# Altium schematic sheet Sheet1.SchDoc
size A4; DocumentNumber: 1; Revision: 0.1; SheetNumber: 1; SheetTotal: 1; HTL_Gruppe: I; HTL_Klasse: 5CHEL; HTL_Zusaetzlicher_Titel: With Arduino; HTL_Schueler_Name: Lukas Krahbichler; PageSetup: Record=PageOptions|CenterHorizontal=True|CenterVertical=True|PrintScale=1.00|XCorrection=1.00|YCorrection=1.00|PrintKind=0|BorderSize=5000000|LeftOffset=0|BottomOffset=0|Orientation=2|PaperLength=1000|PaperWidth=1000|Scale=100|PaperSource=7|PrintQuality=-4|MediaType=1|DitherType=10|PaperKind=A4|PrintScaleMode=1; HTL_Projektname: Diploma PCB; HTL_Dokumentenart: Draft; HTL_Dokumentenstatus: In Progress; SPICEModelCacheJJSVLZZY: <root> / <DocumentId>JJSVLZZY</DocumentId> / <CacheFrame Number="0"> / <Model Name="led_red" Kind="MDL"> / <Text>*Typ RED GaAs LED: Vf=1.7V Vr=4V If=40mA trr=3uS / *LED Pinout: 1=A, 2=K / .MODEL LED_RED D (IS=93.2P RS=42M N=3.73 BV=4 IBV=10U / + CJO=2.97P VJ=.75 M=.333 TT=4.32U)</Text> / </Model> / <Model Name="led_blue" Kind="MDL"> / <Text>*Typ BLUE SiC LED: Vf=3.4V Vr=5V If=40mA trr=3uS / *LED Pinout: 1=A, 2=K / .MODEL LED_BLUE D (IS=93.1P RS=42M N=7.47 BV=5 IBV=30U / + CJO=2.97P VJ=.75 M=.333 TT=4.32U)</Text> / </Model> / <Model Name="led_grn_yel" Kind="MDL"> / <Text>*Typ RED,GREEN,YELLOW,AMBER GaAs LED: Vf=2.1V Vr=4V If=40mA trr=3uS / *LED Pinout: 1=A, 2=K / .MODEL LED_GRN_YEL D (IS=93.1P RS=42M N=4.61 BV=4 IBV=10U / + CJO=2.97P VJ=.75 M=.333 TT=4.32U)</Text> / </Model> / </CacheFrame> / </root>
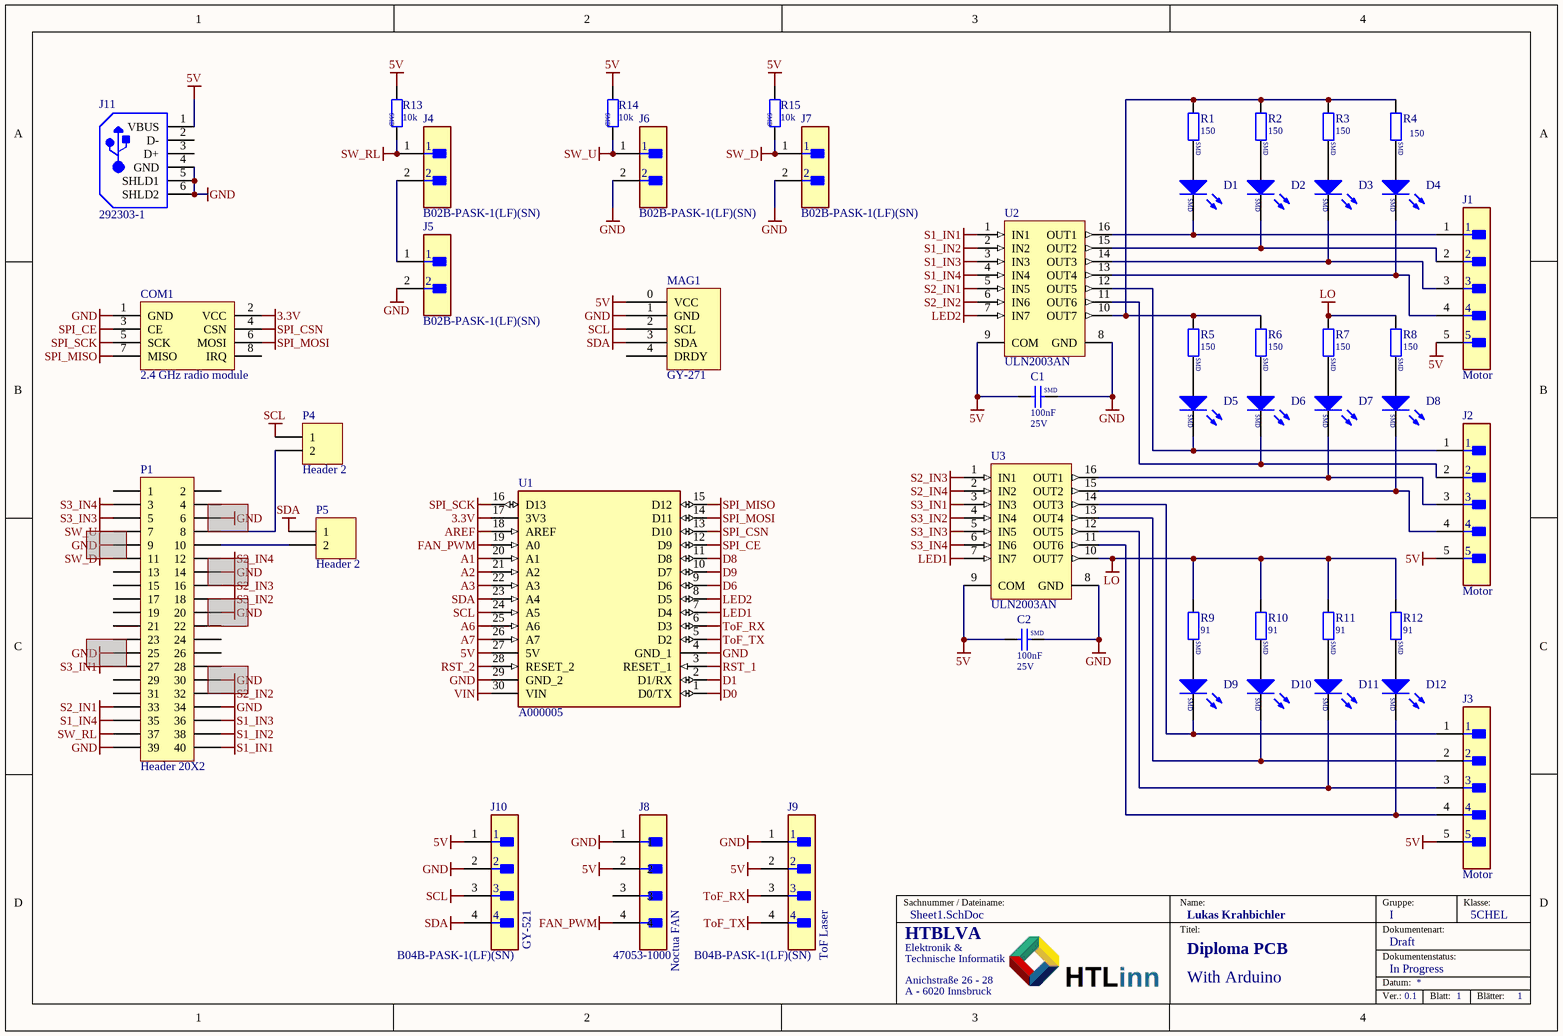
[diagram p0: Sheet1.SchDoc]

## Parts
C1  Rated Voltage: 25V  [C_SMD_C0402]  (hidden comment: 100nF)
C2  Rated Voltage: 25V  [C_SMD_C0402]  (hidden comment: 100nF)
COM1  2.4 GHz radio module  [nRF24L01]
D1  SMD LED RED  [SMD_0603_CHIP-LED]  (value not drawn)
D2  SMD LED RED  [SMD_0603_CHIP-LED]  (value not drawn)
D3  SMD LED RED  [SMD_0603_CHIP-LED]  (value not drawn)
D4  SMD LED RED  [SMD_0603_CHIP-LED]  (value not drawn)
D5  SMD LED GREEN  [SMD_0603_CHIP-LED]  (value not drawn)
D6  SMD LED GREEN  [SMD_0603_CHIP-LED]  (value not drawn)
D7  SMD LED GREEN  [SMD_0603_CHIP-LED]  (value not drawn)
D8  SMD LED GREEN  [SMD_0603_CHIP-LED]  (value not drawn)
D9  SMD LED BLUE  [SMD_0603_CHIP-LED]  (value not drawn)
D10  SMD LED BLUE  [SMD_0603_CHIP-LED]  (value not drawn)
D11  SMD LED BLUE  [SMD_0603_CHIP-LED]  (value not drawn)
D12  SMD LED BLUE  [SMD_0603_CHIP-LED]  (value not drawn)
J1  Motor  [FP-B5B-XH-AM_LF_SN-MFG]
J2  Motor  [FP-B5B-XH-AM_LF_SN-MFG]
J3  Motor  [FP-B5B-XH-AM_LF_SN-MFG]
J4  B02B-PASK-1(LF)(SN)  [FP-B02B-PASK-1_LF_SN-MFG]
J5  B02B-PASK-1(LF)(SN)  [FP-B02B-PASK-1_LF_SN-MFG]
J6  B02B-PASK-1(LF)(SN)  [FP-B02B-PASK-1_LF_SN-MFG]
J7  B02B-PASK-1(LF)(SN)  [FP-B02B-PASK-1_LF_SN-MFG]
J8  47053-1000  [FP-470531000-MFG]
J9  B04B-PASK-1(LF)(SN)  [FP-B04B-PASK-1_LF_SN-MFG]
J10  B04B-PASK-1(LF)(SN)  [FP-B04B-PASK-1_LF_SN-MFG]
J11  292303-1  [TE-292303-1_V]
MAG1  GY-271  [GY271]
P1  Header 20X2  [HDR2X20]
P4  Header 2  [HDR1X2]
P5  Header 2  [HDR1X2]
R1  150  [R_SMD_R0402]
R2  150  [R_SMD_R0402]
R3  150  [R_SMD_R0402]
R4  150  [R_SMD_R0402]
R5  150  [R_SMD_R0402]
R6  150  [R_SMD_R0402]
R7  150  [R_SMD_R0402]
R8  150  [R_SMD_R0402]
R9  91  [R_SMD_R0402]
R10  91  [R_SMD_R0402]
R11  91  [R_SMD_R0402]
R12  91  [R_SMD_R0402]
R13  10k  [R_SMD_R0402]
R14  10k  [R_SMD_R0402]
R15  10k  [R_SMD_R0402]
U1  A000005  [MODULE_A000005]
U2  ULN2003AN  [STM-DIP-16L]
U3  ULN2003AN  [STM-DIP-16L]

## Nets
3.3V: COM1.2(VCC) U1.17(3V3)
5V: C1.1 C2.1 J1.5 J2.5 J3.5 J8.2 J9.2 J10.1 J11.1(VBUS) MAG1.0(VCC) R13.1 R14.1 R15.1 U1.27(5V) U2.9(COM) U3.9(COM)
A1: U1.20(A1)
A2: U1.21(A2)
A3: U1.22(A3)
A6: U1.25(A6)
A7: U1.26(A7)
AREF: U1.18(AREF)
D0: U1.1(D0/TX)
D1: U1.2(D1/RX)
D6: U1.9(D6)
D8: U1.11(D8)
D9: U1.10(D7)
FAN_PWM: J8.4 U1.19(A0)
GND: C1.2 C2.2 COM1.1(GND) J5.2 J6.2 J7.2 J8.1 J9.1 J10.2 J11.4(GND) J11.5(SHLD1) J11.6(SHLD2) MAG1.1(GND) P1.34 P1.39 U1.4(GND_1) U1.29(GND_2) U2.8(GND) U3.8(GND)
LED1: U1.7(D4) U3.7(IN7)
LED2: U1.8(D5) U2.7(IN7)
LO: R7.1 R8.1 R9.1 R10.1 R11.1 R12.1 U3.10(OUT7)
RST_1: U1.3(RESET_1)
RST_2: U1.28(RESET_2)
S1_IN1: P1.40 U2.1(IN1)
S1_IN2: P1.38 U2.2(IN2)
S1_IN3: P1.36 U2.3(IN3)
S1_IN4: P1.35 U2.4(IN4)
S2_IN1: P1.33 U2.5(IN5)
S2_IN2: U2.6(IN6)
S2_IN3: U3.1(IN1)
S2_IN4: U3.2(IN2)
S3_IN1: U3.3(IN3)
S3_IN2: U3.4(IN4)
S3_IN3: P1.5 U3.5(IN5)
S3_IN4: P1.3 U3.6(IN6)
SCL: J10.3 MAG1.2(SCL) P4.1 U1.24(A5)
SDA: J10.4 MAG1.3(SDA) P5.1 U1.23(A4)
SPI_CE: COM1.3(CE) U1.12(D9)
SPI_CSN: COM1.4(CSN) U1.13(D10)
SPI_MISO: COM1.7(MISO) U1.15(D12)
SPI_MOSI: COM1.6(MOSI) U1.14(D11)
SPI_SCK: COM1.5(SCK) U1.16(D13)
SW_D: J7.1 R15.2
SW_RL: J4.1 P1.37 R13.2
SW_U: J6.1 R14.2
ToF_RX: J9.3 U1.6(D3)
ToF_TX: J9.4 U1.5(D2)
VIN: U1.30(VIN)
NetD1_A: D1.A R1.2
NetD1_K: D1.K J1.1 U2.16(OUT1)
NetD2_A: D2.A R2.2
NetD2_K: D2.K J1.2 U2.15(OUT2)
NetD3_A: D3.A R3.2
NetD3_K: D3.K J1.3 U2.14(OUT3)
NetD4_A: D4.A R4.2
NetD4_K: D4.K J1.4 U2.13(OUT4)
NetD5_A: D5.A R5.2
NetD5_K: D5.K J2.1 U2.12(OUT5)
NetD6_A: D6.A R6.2
NetD6_K: D6.K J2.2 U2.11(OUT6)
NetD7_A: D7.A R7.2
NetD7_K: D7.K J2.3 U3.16(OUT1)
NetD8_A: D8.A R8.2
NetD8_K: D8.K J2.4 U3.15(OUT2)
NetD9_A: D9.A R9.2
NetD9_K: D9.K J3.1 U3.14(OUT3)
NetD10_A: D10.A R10.2
NetD10_K: D10.K J3.2 U3.13(OUT4)
NetD11_A: D11.A R11.2
NetD11_K: D11.K J3.3 U3.12(OUT5)
NetD12_A: D12.A R12.2
NetD12_K: D12.K J3.4 U3.11(OUT6)
NetJ4_2: J4.2 J5.1
NetP1_8: P1.8 P4.2
NetP1_10: P1.10 P5.2
NetR1_1: R1.1 R2.1 R3.1 R4.1 R5.1 R6.1 U2.10(OUT7)

Not connected (* = marked no-connect by the designer): COM1 8(IRQ); J8 3; J11 2(D-) 3(D+); MAG1 4(DRDY); P1 1 2 4 6 7 9 11 12 13 14 15 16 17 18 19 20 21 22 23 24 25 26 27 28 29 30 31 32

## Notes on the sheet
- (near J10) GY-521
- (near J8) Noctua FAN
- (near J9) ToF Laser
- Sachnummer / Dateiname:
- Name:
- Gruppe:
- Klasse:
- Elektronik &
- Technische Informatik
- Anichstraße 26 - 28
- HTBLVA
- Titel:
- Datum:
- Dokumentenart:
- Dokumentenstatus:
- A - 6020 Innsbruck
- Ver.:
- Blatt:
- Blätter:
- (in symbol C_SMD) SMD
- (in symbol R_SMD) SMD
- (in symbol SMD_LED_BLUE) SMD
- (in symbol SMD_LED_GREEN) SMD
- (in symbol SMD_LED_RED) SMD

## Library data of the parts
C1 C2 = C_SMD: SMD Capacitor; Usage: only permitted for non-commercial purposes at HTL I Innsbruck; Published: 21-Feb-2011; LatestRevisionDate: 07-Sep-2019; Value: 100nF
COM1 = nRF24L01: Header, 4-Pin, Dual row; pin to pad: 1>GND 2>VCC 3>CE 4>CSN 5>SCK 6>MOSI 7>MISO 8>IRQ; LatestRevisionDate: 17-Jul-2002; LatestRevisionNote: Re-released for DXP Platform.; Publisher: Altium Limited
D1-D4 = SMD_LED_RED: Red GaAs LED (Vf=2V, If=20mA); Usage: only permitted for non-commercial purposes at HTL I Innsbruck; SimulationModellSource: Miscellaneous Devices; Published: 29-Mar-2017; LatestRevisionDate: 21-Jun-2015
D5-D8 = SMD_LED_GREEN: Green GaAs LED (Vf=2V, If=20mA); Usage: only permitted for non-commercial purposes at HTL I Innsbruck; SimulationModellSource: Miscellaneous Devices; Published: 29-Mar-2017; LatestRevisionDate: 21-Jun-2015
D9-D12 = SMD_LED_BLUE: Blue SiC LED (Vf=3.2V, If=20mA); Usage: only permitted for non-commercial purposes at HTL I Innsbruck; SimulationModellSource: Miscellaneous Devices; Published: 29-Mar-2017; LatestRevisionDate: 21-Jun-2015
J1-J3 = CMP-17439-000304-1: CONN HEADER VERT 5POS 2.5MM; Mated Stacking Heights: 9.8mm; Voltage Rating: 250V; Max Current Rating: 3A; Number of Positions: 5; Contact Resistance: 20mR; Depth: 5.75mm; Connector Type: Header; Color: Green; Insulation Material: Nylon; Contact Plating: Copper; Length: 14.9mm; Fastening Type: Detent; Contact Material: Brass; Number of Rows: 1; Contact Type: Male Pin; Housing Material: Polyamide; Housing Color: White; Lead Free: Lead Free; Max Voltage Rating (AC): 250V; Mount: Through Hole; Contact Shape: Square; Min Operating Temperature: -25°C; Packaging: Bulk; Orientation: Straight; Insulation Color: Natural; Series: XH; Flammability Rating: UL94 V-0; Contact Finish - Mating: TIN; Max Operating Temperature: 85°C; Termination: Solder; Pitch: 2.5mm
J4-J7 = CMP-17439-000415-1: CONN HEADER VERT 2POS 2MM; Number of Contacts: 2; Current Rating: 3A; Insulation Resistance: 1GR; Mated Stacking Heights: 14.9mm; Voltage Rating: 250V; Gender: Male; Pitch: 2mm; Orientation: Straight; Contact Finish - Mating: TIN; Mount: Through Hole; Contact Type: Male Pin; Number of Rows: 1; Fastening Type: Ramp; Series: PA; Connector Type: Header; Insulation Color: Natural; Flammability Rating: UL94 V-0; Material: Polybutylene; Contact Shape: Square; Contact Plating: Tin; Insulation Material: PBT; Max Operating Temperature: 85°C; Housing Color: White; Number of Positions: 2; Contact Material: Copper Alloy; Min Operating Temperature: -25°C; Lead Free: Lead Free; Contact Mating Length: 0.126inch; Termination: Solder; Packaging: Bulk; Color: Natural
J8 = CMP-04776-000290-2: CONN HEADER VERT 4POS 2.54MM; NexarPartId: 854935; Manufacturer Lifecycle Status: ACTIVE; Voltage Rating (DC): 250V; Gender: Male; Plating: Copper; Number of Positions: 4; Glow Wire Compliant: Non-compliant; Current Rating: 500mA; Max Operating Temperature: 75°C; Number of Rows: 1; REACH SVHC: Unknown; Ambient Temperature Range High: 105°C; Pitch: 2.54mm; Height: 7.7mm; Min Operating Temperature: 0°C; Packaging: Bulk; Contact Material: Brass, Copper; Contact Plating: Tin; Lead Pitch: 2.54mm; Voltage Rating: 250V; Termination: Through Hole; Radiation Hardening: No; Orientation: Vertical; Mount: Through Hole; Number of Pins: 4; Country of Origin: HK; Halogen Free: Low Halogen; Lifecycle Status: Production; Number of Circuits: 4; Schedule B: 8536694040, 8536694040; Housing Color: Beige; Housing Material: Nylon; Depth: 5.84mm; RoHS: Compliant; Length: 10.2mm; Number of Contacts: 4
J9 J10 = CMP-17439-000192-1: CONN HEADER VERT 4POS 2MM; Voltage Rating: 250V; Number of Positions: 4; Current Rating: 3A; Mated Stacking Heights: 14.9mm; Gender: Male; Contact Resistance: 20mR; Termination: Solder; Length: 10mm; Number of Rows: 1; Depth: 5.3mm; Contact Plating: Copper; Packaging: Bulk; Housing Color: White; Contact Shape: Square; Contact Mating Length: 0.126inch; Color: Natural; Min Operating Temperature: -25°C; Fastening Type: Ramp; Max Current Rating: 3A; Lead Free: Lead Free; Flammability Rating: UL94 V-0; Connector Type: Header; Contact Finish - Mating: TIN; Max Voltage Rating (AC): 250V; Mount: Through Hole; Number of Contacts: 4; Orientation: Straight; Series: PA; Pitch: 2mm; Insulation Color: Natural; Contact Material: Copper Alloy; Max Operating Temperature: 85°C; Contact Type: Male Pin; Insulation Material: PBT
J11 = CMP-2000-05404-1: 1 Port Right Angle Through Hole Mount Female Type A USB Connector, 4 Position, -55 to 85 degC, RoHS, Tube; Manufacturer: TE Connectivity; Contact Termination Type: Solder; No. of Contacts: 4; Connector Mounting: PCB; SVHC: NoSVHC(16-Jun-2014); Gender: Receptacle; Connector Type: USBA; Package Description: 4-Pin Through Hole Device, Body 14 x 13.13 mm, Pitch 2.5 mm; Contact Plating: Gold; Package Reference: 292303-1; Contact Material: Copper; Datasheet URL: http://www.farnell.com/cad/1653030.pdf; Datasheet Version: Feb-12; Manufacturer URL: http://www.te.com/
MAG1 = GY271: I2C Compass Module Compass Magnet Sensor; pin to pad: 0>VCC 1>GND 2>SCL 3>SDA 4>DRDY
P1 = Header 20X2: Header, 20-Pin, Dual row; LatestRevisionDate: 17-Jul-2002; LatestRevisionNote: Re-released for DXP Platform.; Publisher: Altium Limited
P4 P5 = Header 2: Header, 2-Pin; LatestRevisionDate: 17-Jul-2002; LatestRevisionNote: Re-released for DXP Platform.; Publisher: Altium Limited
R1-R15 = R_SMD: SMD Resistor; Usage: only permitted for non-commercial purposes at HTL I Innsbruck; Published: 21-Feb-2011; LatestRevisionDate: 07-Sep-2019
  R1-R8: Value: 150
  R9-R12: Value: 91
  R13-R15: Value: 10k
U1 = A000005: Small, complete, and breadboard-friendly board based on the ATmega328 (Arduino Nano 3.x).; Check_prices: https://www.snapeda.com/parts/A000005/Arduino/view-part/?ref=eda; Value: *; Availability: In Stock; MP: A000005; Price: None; Package: Non-Standard Arduino; SnapEDA_Link: https://www.snapeda.com/parts/A000005/Arduino/view-part/?ref=snap; Purchase-URL: https://pricing.snapeda.com/search/part/A000005/?ref=eda; MF: Arduino
U2 U3 = CMP-2000-07351-1: Seven Darlington Array, 50 V, 0.5 A, -40 to 85 degC, 16-Pin DIP, RoHS, Tube; Manufacturer: STMicroelectronics; Transistor Polarity: NPN; VOUT: 50V; No. of Pins: 16Pins; SVHC: NoSVHC(17-Dec-2015); DC Current Gain hFE: 1000hFE; Output Current: 0.5A; DC Collector Current: 500mA; Transistor Case Style: DIP; Package Reference: DIP-16L; Automotive Qualification Standard: -; Mounting Technology: ThroughHole; Power Dissipation Pd: -; Collector Emitter Voltage V(br)ceo: 50V; Datasheet URL: http://www2.st.com/content/ccc/resource/technical/document/datasheet/f3/6e/c8/64/4d/b3/4e/38/CD00001244.pdf/files/CD00001244.pdf/jcr:content/translations/en.CD00001244.pdf; Manufacturer URL: http://www.st.com/; PartNumber: ULN2003A; MSL: MSL2-1year; Product Range: -; Package Description: 16-Pin DIP, Body 19.7 x 7.1 mm, Pitch 2.54 mm; Operating Temperature Max: 85°C; Datasheet Version: Rev. 8, 06/2012